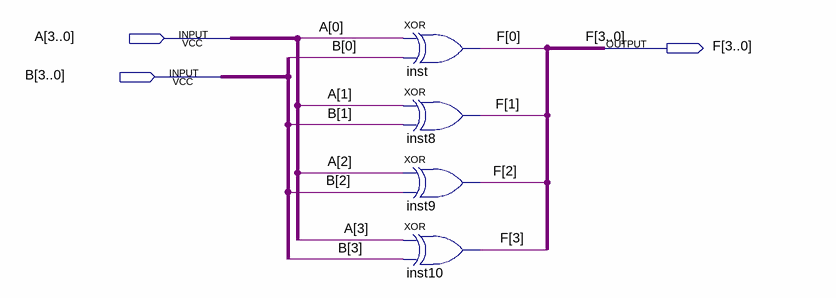
[diagram p0: schematic sheet]
// Quartus schematic 4b_xor.bdf as structural Verilog: 4 symbols, 3 pins
module \4b_xor  (
  input  [3:0] A,
  input  [3:0] B,
  output [3:0] F
);

  xor inst (F[0], A[0], B[0]);
  xor inst8 (F[1], A[1], B[1]);
  xor inst9 (F[2], A[2], B[2]);
  xor inst10 (F[3], A[3], B[3]);
endmodule
